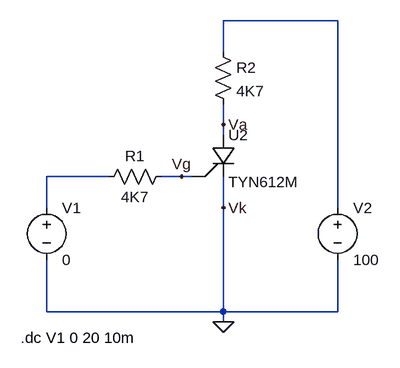
[diagram p0: schematic ej1.asc]
ej1.asc, the LTspice schematic file:
Version 4.1
SHEET 1 2236 680
WIRE 496 -160 320 -160
WIRE 320 -112 320 -160
WIRE 320 0 320 -32
WIRE 320 16 320 0
WIRE 144 80 48 80
WIRE 256 80 224 80
WIRE 272 80 256 80
WIRE 48 128 48 80
WIRE 320 128 320 80
WIRE 496 128 496 -160
WIRE 48 288 48 208
WIRE 320 288 320 128
WIRE 320 288 48 288
WIRE 496 288 496 208
WIRE 496 288 320 288
WIRE 320 304 320 288
FLAG 320 304 0
FLAG 256 80 Vg
FLAG 320 0 Va
FLAG 320 128 Vk
SYMBOL voltage 48 112 R0
WINDOW 123 0 0 Left 0
WINDOW 39 0 0 Left 0
SYMATTR InstName V1
SYMATTR Value 0
SYMBOL res 240 64 R90
WINDOW 0 0 56 VBottom 2
WINDOW 3 32 56 VTop 2
SYMATTR InstName R1
SYMATTR Value 4K7
SYMBOL res 304 -128 R0
SYMATTR InstName R2
SYMATTR Value 4K7
SYMBOL voltage 496 112 R0
WINDOW 123 0 0 Left 0
WINDOW 39 0 0 Left 0
SYMATTR InstName V2
SYMATTR Value 100
SYMBOL TYN612M 304 16 R0
SYMATTR InstName U2
TEXT 8 328 Left 2 !.dc V1 0 20 10m

The netlist it stands for:
* ej1.asc
V1 N002 0 0
R1 Vg N002 4K7
R2 N001 Va 4K7
V2 N001 0 100
X§U2 Va 0 Vg TYN612M  ; pins A K G
.dc V1 0 20 10m
.lib C:\Users\gasto\OneDrive\Documentos\UTN\Dispositivos-electronicos-I\tp5\simulaciones\tny612m.lib
.backanno
.end

* Results of the author's LTspice run, read from the files saved beside the schematic
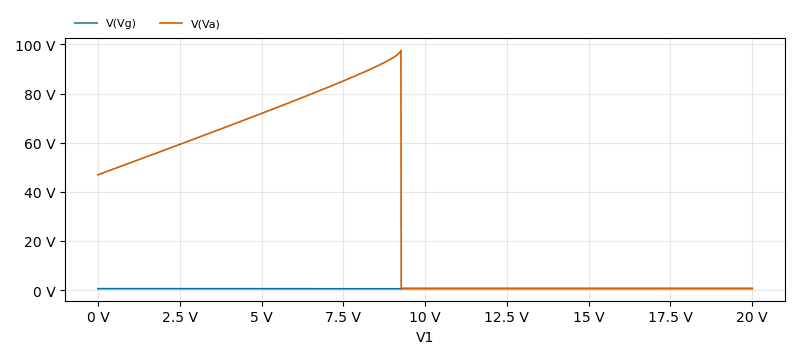
[diagram p1: DC transfer characteristic of ej1.asc, plotted from the saved traces]
* DC transfer characteristic, 1 run:
*   V(Vg): 590 mV at V1=0 V, 659.2 mV at V1=20 V, min 530.2 mV, max 659.2 mV
*   V(Va): 46.93 V at V1=0 V, 644.3 mV at V1=20 V, min 644.3 mV, max 97.56 V